# Altium schematic sheet Controller(2).SchDoc
size A4
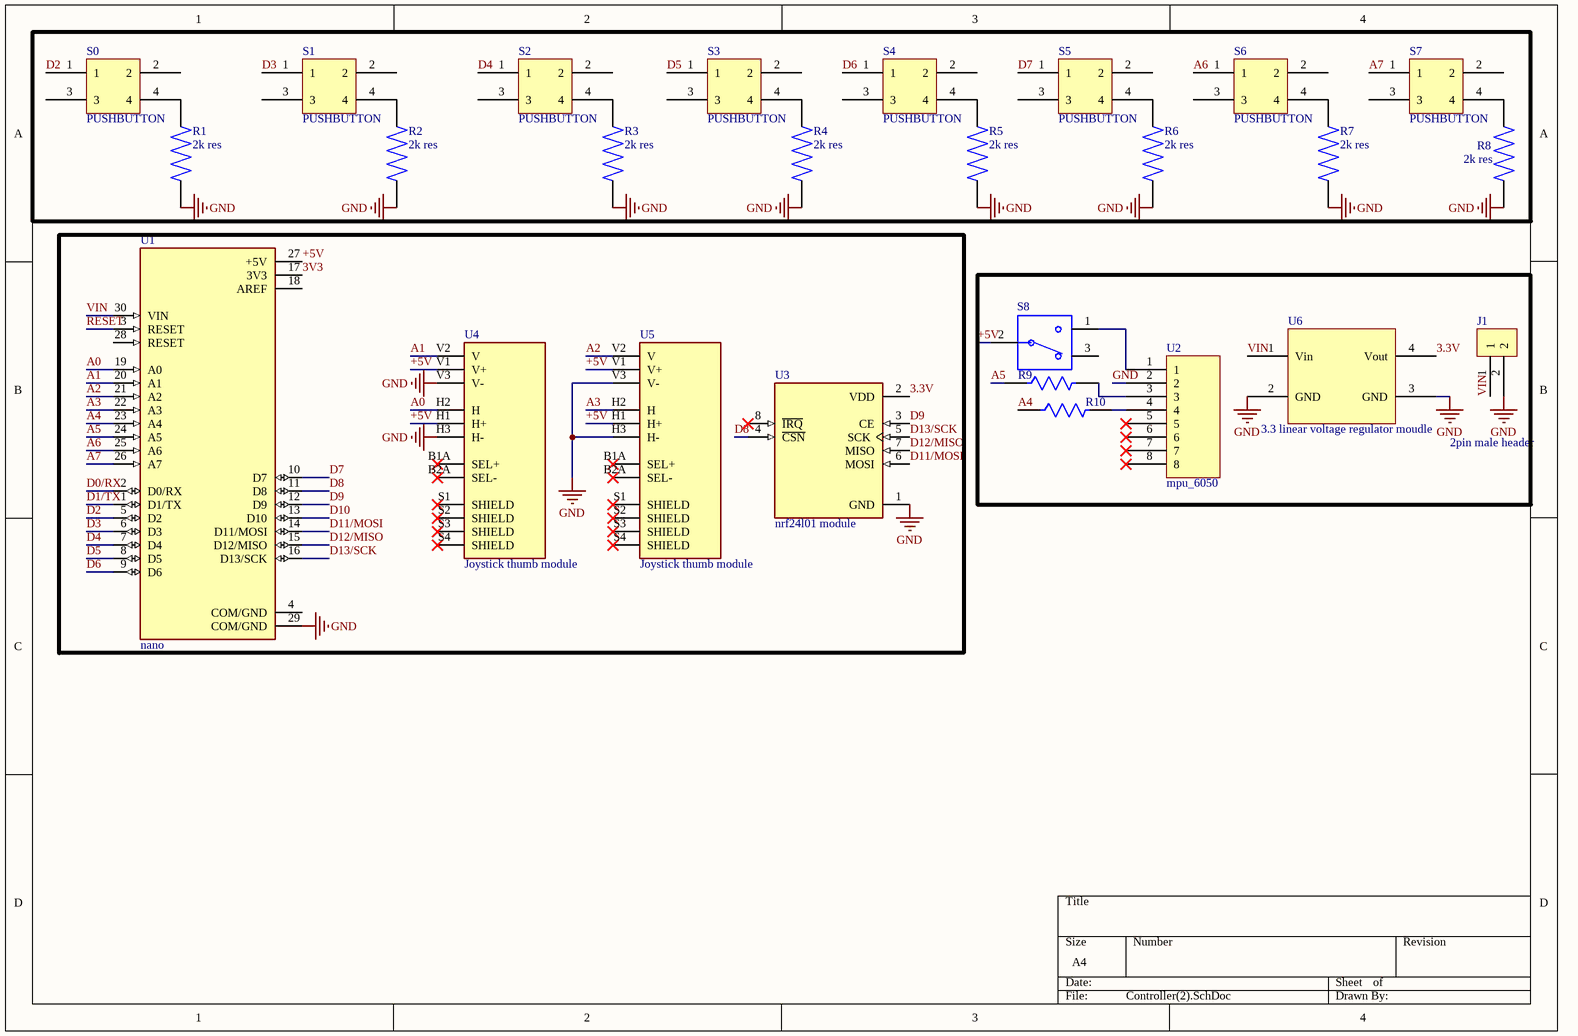
[diagram p0: Controller(2).SchDoc]

## Parts
J1  2pin male header  [2pin]
R1  2k res  [1k res]
R2  2k res  [1k res]
R3  2k res  [1k res]
R4  2k res  [1k res]
R5  2k res  [1k res]
R6  2k res  [1k res]
R7  2k res  [1k res]
R8  2k res  [1k res]
R9  10k ohm resistor  [10k res]  (value not drawn)
R10  10k ohm resistor  [10k res]  (value not drawn)
S0  PUSHBUTTON  [pushbutton]
S1  PUSHBUTTON  [pushbutton]
S2  PUSHBUTTON  [pushbutton]
S3  PUSHBUTTON  [pushbutton]
S4  PUSHBUTTON  [pushbutton]
S5  PUSHBUTTON  [pushbutton]
S6  PUSHBUTTON  [pushbutton]
S7  PUSHBUTTON  [pushbutton]
S8  Slide Switch  [slide_switch]  (value not drawn)
U1  nano  [nano]
U2  mpu_6050  [MPU_6050]
U3  nrf24l01 module  [NRF24L01_1]
U4  Joystick thumb module  [Joystick_9050]
U5  Joystick thumb module  [Joystick_9050]
U6  3.3 linear voltage regulator moudle  [ams1117_module]

## Nets
GND: J1.2 R1.2 R2.2 R3.2 R4.2 R5.2 R6.2 R7.2 R8.2 U1.29(COM/GND) U2.2 U3.1(GND) U4.H3(H-) U4.V3(V-) U5.H3(H-) U5.V3(V-) U6.2(GND) U6.3(GND)
3.3V: U3.2(VDD) U6.4(Vout)
3V3: U1.17(3V3)
+5V: S8.2 U1.27(+5V) U4.H1(H+) U4.V1(V+) U5.H1(H+) U5.V1(V+)
A0: U1.19(A0) U4.H2(H)
A1: U1.20(A1) U4.V2(V)
A2: U1.21(A2) U5.V2(V)
A3: U1.22(A3) U5.H2(H)
A4: R10.1 U1.23(A4)
A5: R9.1 U1.24(A5)
A6: S6.1 U1.25(A6)
A7: S7.1 U1.26(A7)
D0/RX: U1.2(D0/RX)
D1/TX: U1.1(D1/TX)
D2: S0.1 U1.5(D2)
D3: S1.1 U1.6(D3)
D4: S2.1 U1.7(D4)
D5: S3.1 U1.8(D5)
D6: S4.1 U1.9(D6)
D7: S5.1 U1.10(D7)
D8: U1.11(D8) U3.4(~{CSN})
D9: U1.12(D9) U3.3(CE)
D10: U1.13(D10)
D11/MOSI: U1.14(D11/MOSI) U3.6(MOSI)
D12/MISO: U1.15(D12/MISO) U3.7(MISO)
D13/SCK: U1.16(D13/SCK) U3.5(SCK)
RESET: U1.3(RESET)
VIN: J1.1 U1.30(VIN) U6.1(Vin)
NetR1_1: R1.1 S0.4
NetR2_1: R2.1 S1.4
NetR3_1: R3.1 S2.4
NetR4_1: R4.1 S3.4
NetR5_1: R5.1 S4.4
NetR6_1: R6.1 S5.4
NetR7_1: R7.1 S6.4
NetR8_1: R8.1 S7.4
NetR9_2: R9.2 U2.3
NetR10_2: R10.2 U2.4
NetS8_1: S8.1 U2.1

Not connected (* = marked no-connect by the designer): S0 2 3; S1 2 3; S2 2 3; S3 2 3; S4 2 3; S5 2 3; S6 2 3; S7 2 3; S8 3; U1 4(COM/GND) 18(AREF) 28(RESET); U2 5* 6* 7* 8*; U3 8(~{IRQ})*; U4 B1A(SEL+)* B2A(SEL-)* S1(SHIELD)* S2(SHIELD)* S3(SHIELD)* S4(SHIELD)*; U5 B1A(SEL+)* B2A(SEL-)* S1(SHIELD)* S2(SHIELD)* S3(SHIELD)* S4(SHIELD)*

## Library data of the parts
J1 = 2pin
R1-R8 = 1k res
R9 R10 = 10k res
S8 = slide_switch
U3 = nrf24l01
U4 U5 = Joystick_9050
U6 = am1117_module